# Altium schematic sheet voltage-reference-5.0V.SchDoc
size A3; DocumentNumber: 39; SheetNumber: 39; SheetTotal: 45; SheetDescription: 5.0V reference voltage
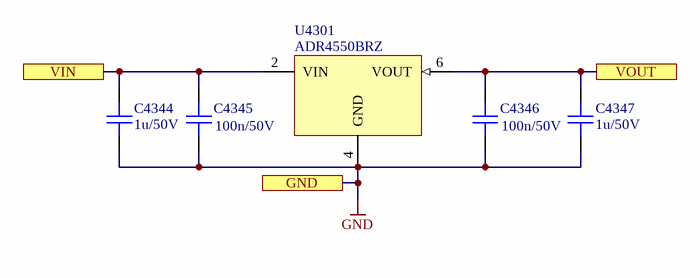
[diagram p0: voltage-reference-5.0V.SchDoc]

## Parts
C4344  1u/50V  [CAPC1608X08N]
C4345  100n/50V  [CAPC1005X06N]
C4346  100n/50V  [CAPC1005X06N]
C4347  1u/50V  [CAPC1608X08N]
U4301  ADR4550BRZ  [SOIC127P600X175-8N]

## Ports
GND, VIN, VOUT

## Nets
GND: C4344.1 C4345.1 C4346.1 C4347.1 U4301.4(GND) ; port GND
VIN: C4344.2 C4345.2 U4301.2(VIN) ; port VIN
VOUT: C4346.2 C4347.2 U4301.6(VOUT) ; port VOUT

## Notes on the sheet
- Fraunhofer IISB
- Schottkystr. 10
- developed by:
- 91058 Erlangen
- Germany
- Author
- Project
- License
- Description
- File
- Version
- Release Date
- Sheet
- foxbms.org <https://foxbms.org>
- www.iisb.fraunhofer.de <https://www.iisb.fraunhofer.de/>
- foxBMS Team
- /

## Library data of the parts
C4344 C4347 = gen_C_ceramic_1u_50V_X7R_0603: MLCC; Capacitance: 1u; Rated Voltage: 50V; Dielectric: X7R; Tolerance: ± 10%; Case EIA: 0603; Case Metric: 1608; Automotive Qualified: False; PnP Package: 0603C; Part Number: gen_C_ceramic_1u_50V_X7R_0603; Operating Temperature: -55°C - +125°C; Supplier 1: Farnell; Supplier Part Number 1: 2779055
C4345 C4346 = gen_C_ceramic_100n_50V_X7R_0402: MLCC; Capacitance: 100n; Rated Voltage: 50V; Dielectric: X7R; Case EIA: 0402; Case Metric: 1005; PnP Package: 0402C; PnP Value: 100nF/50V/X7R; PnP equipped: x; Automotive Qualified: True; AEC-Q Norm: AEC-Q200; Part Number: gen_C_ceramic_100n_50V_X7R_0402; Supplier 1: Farnell; Supplier Part Number 1: 2210822; ECCN: EAR99
U4301 = ADR4550BRZ: Ultralow Noise, High Accuracy Voltage Reference; Manufacturer: Analog Devices; PnP Package: SO-8; Automotive Qualified: True; AEC-Q Grade: unknown; AEC-Q Norm: AEC-Q100; Part Number: ADR4550BRZ; Part Name: ADR4550BRZ; Operating Temperature: −40°C - +125°C; ComponentLink1Description: Datasheet; ComponentLink1URL: http://www.analog.com/media/en/technical-documentation/data-sheets/ADR4520_4525_4530_4533_4540_4550.pdf; Supplier 1: Farnell; Supplier Part Number 1: 2112695; Supplier 2: Digikey; Supplier Part Number 2: ADR4550BRZ-ND; Supplier 3: Mouser; Supplier Part Number 3: 584-ADR4550BRZ; ECCN: EAR99